# Altium schematic sheet Receiver.SchDoc
size A4
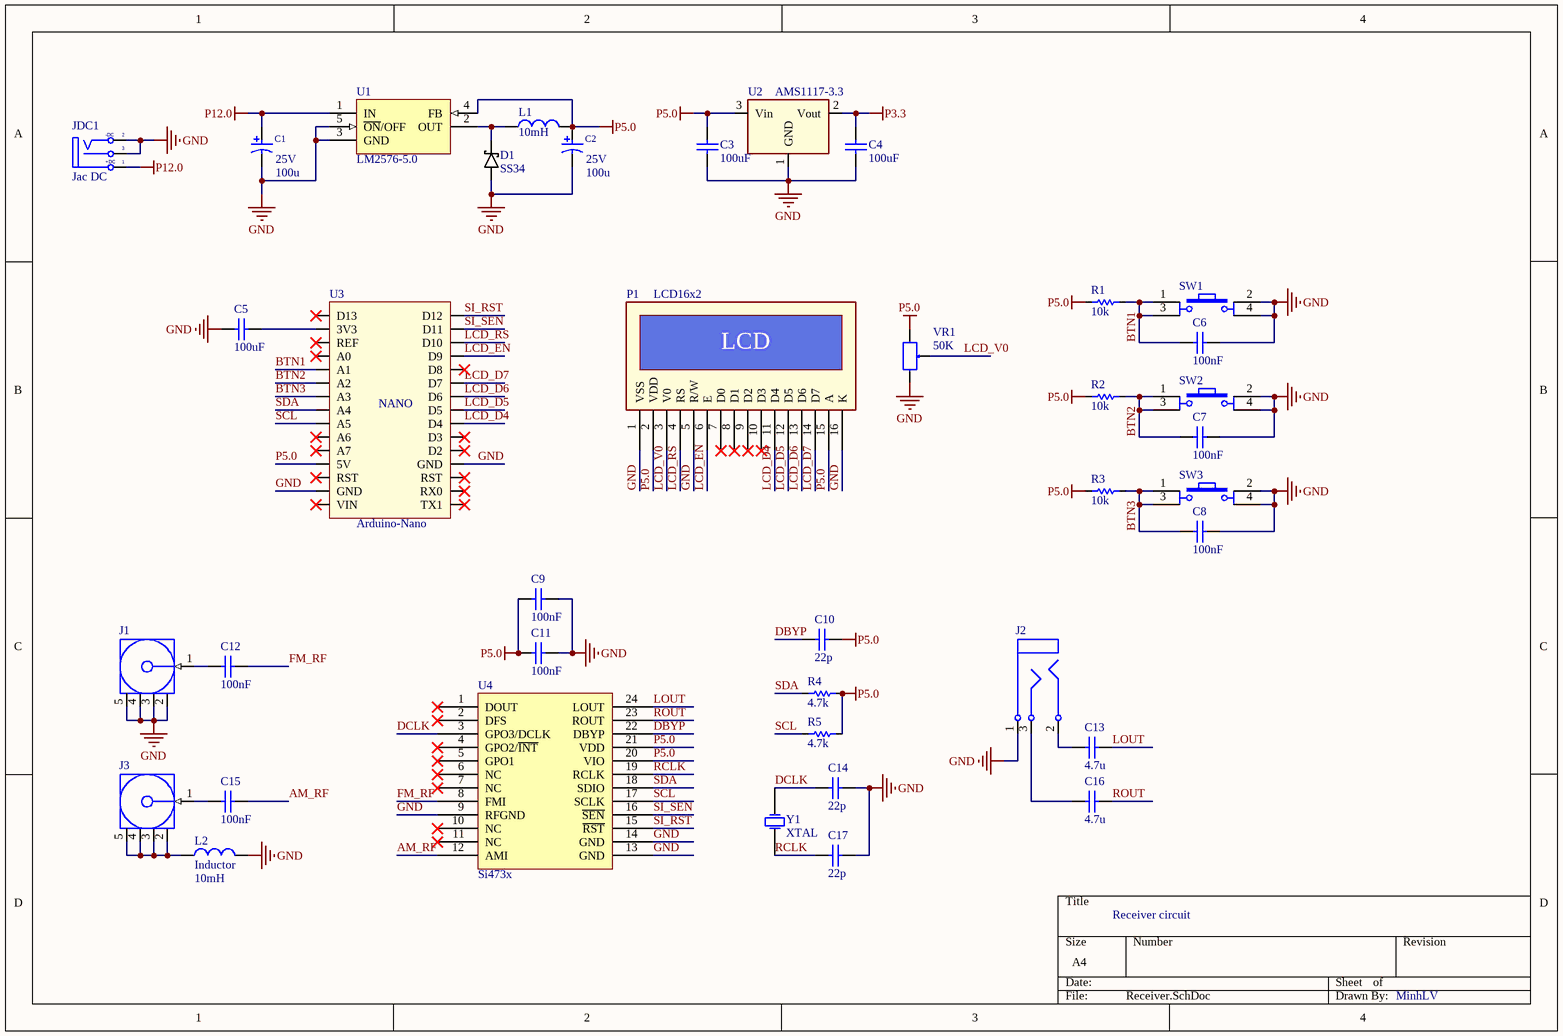
[diagram p0: Receiver.SchDoc]

## Parts
C1  Volt: 25V  [CAP_SMD_6_3MM]  (hidden comment: 100u)
C2  Volt: 25V  [CAP_SMD_6_3MM]  (hidden comment: 100u)
C3  value 100uF  [CAP_SMD_0805]  (hidden comment: Cap Non-pol)
C4  value 100uF  [CAP_SMD_0805]  (hidden comment: Cap Non-pol)
C5  value 100uF  [CAP_SMD_0805]  (hidden comment: Cap Non-pol)
C6  value 100nF  [CAP_SMD_0805]  (hidden comment: Cap Non-pol)
C7  value 100nF  [CAP_SMD_0805]  (hidden comment: Cap Non-pol)
C8  value 100nF  [CAP_SMD_0805]  (hidden comment: Cap Non-pol)
C9  value 100nF  [CAP_SMD_0805]  (hidden comment: Cap Non-pol)
C10  value 22p  [CAP_SMD_0805]  (hidden comment: Cap Non-pol)
C11  value 100nF  [CAP_SMD_0805]  (hidden comment: Cap Non-pol)
C12  value 100nF  [CAP_SMD_0805]  (hidden comment: Cap Non-pol)
C13  value 4.7u  [CAP_SMD_0805]  (hidden comment: Cap Non-pol)
C14  value 22p  [CAP_SMD_0805]  (hidden comment: Cap Non-pol)
C15  value 100nF  [CAP_SMD_0805]  (hidden comment: Cap Non-pol)
C16  value 4.7u  [CAP_SMD_0805]  (hidden comment: Cap Non-pol)
C17  value 22p  [CAP_SMD_0805]  (hidden comment: Cap Non-pol)
D1  SS34  [DO-214AC,SMA]
J1  SMA Connector  [SMA-CONNECTOR]  (value not drawn)
J2  CON.AudioJack Stereo  [SJ-3523-SMT]  (value not drawn)
J3  SMA Connector  [SMA-CONNECTOR]  (value not drawn)
JDC1  Jac DC  [DC-IN]
L1  value 10mH  [CDRH104]  (hidden comment: Inductor)
L2  Inductor  value 10mH  [CDRH104]
P1  LCD16x2  [LCD16x2]
R1  value 10k  [RES_SMD_0805]  (hidden comment: RESISTOR)
R2  value 10k  [RES_SMD_0805]  (hidden comment: RESISTOR)
R3  value 10k  [RES_SMD_0805]  (hidden comment: RESISTOR)
R4  value 4.7k  [RES_SMD_0805]  (hidden comment: RESISTOR)
R5  value 4.7k  [RES_SMD_0805]  (hidden comment: RESISTOR)
SW1  SW  [SW4]  (value not drawn)
SW2  SW  [SW4]  (value not drawn)
SW3  SW  [SW4]  (value not drawn)
U1  LM2576-5.0  [LM2576_SMD]
U2  AMS1117-3.3  [SOT223]
U3  Arduino-Nano  [Arduino Nano]
U4  Si473x  [SSOP-24]
VR1  50K  [VR]
Y1  XTAL  [XT32k]

## Nets
GND: C1.2 C2.2 C3.1 C4.1 C5.1 C6.1 C7.1 C8.1 C9.2 C11.2 C14.1 C17.1 D1.1(A) J1.2(GND) J1.3(GND) J1.4(GND) J1.5(GND) J2.1 JDC1.2(TN) JDC1.3(S) L2.2 P1.1(VSS) P1.5(R/W) P1.16(K) SW1.2 SW1.4 SW2.2 SW2.4 SW3.2 SW3.4 U1.3(GND) U1.5(~{ON}/OFF) U2.1(GND) U3.GND U4.9(RFGND) U4.13(GND) U4.14(GND) VR1.3
P3.3: C4.2 U2.2(Vout)
P5.0: C2.1 C3.2 C9.1 C10.1 C11.1 L1.2 P1.2(VDD) P1.15(A) R1.1 R2.1 R3.1 R4.2 R5.2 U1.4(FB) U2.3(Vin) U3.5V U4.20(VIO) U4.21(VDD) VR1.1
P12.0: C1.1 JDC1.1(T) U1.1(IN)
AM_RF: C15.2 U4.12(AMI)
BTN1: C6.2 R1.2 SW1.1 SW1.3 U3.A1
BTN2: C7.2 R2.2 SW2.1 SW2.3 U3.A2
BTN3: C8.2 R3.2 SW3.1 SW3.3 U3.A3
DBYP: C10.2 U4.22(DBYP)
DCLK: C14.2 U4.3(GPO3/DCLK) Y1.1(OSC1)
FM_RF: C12.2 U4.8(FMI)
LCD_D4: P1.11(D4) U3.D4
LCD_D5: P1.12(D5) U3.D5
LCD_D6: P1.13(D6) U3.D6
LCD_D7: P1.14(D7) U3.D7
LCD_EN: P1.6(E) U3.D9
LCD_RS: P1.4(RS) U3.D10
LCD_V0: P1.3(V0) VR1.2
LOUT: C13.1 U4.24(LOUT)
RCLK: C17.2 U4.19(RCLK) Y1.2(OSC2)
ROUT: C16.1 U4.23(ROUT)
SCL: R5.1 U3.A5 U4.17(SCLK)
SDA: R4.1 U3.A4 U4.18(SDIO)
SI_RST: U3.D12 U4.15(~{RST})
SI_SEN: U3.D11 U4.16(~{SEN})
NetC5_2: C5.2 U3.3V3
NetC12_1: C12.1 J1.1(Signal)
NetC13_2: C13.2 J2.2
NetC15_1: C15.1 J3.1(Signal)
NetC16_2: C16.2 J2.3
NetD1_2: D1.2(K) L1.1 U1.2(OUT)
NetJ3_2: J3.2(GND) J3.3(GND) J3.4(GND) J3.5(GND) L2.1

Not connected (* = marked no-connect by the designer): P1 7(D0)* 8(D1)* 9(D2)* 10(D3)*; U3 A0* A6* A7* D2* D3* D8* D13* REF* RST* RX0* TX1* VIN*; U4 1(DOUT)* 2(DFS)* 4(GPO2/~{INT})* 5(GPO1)* 6(NC)* 7(NC)* 10(NC)* 11(NC)*

## Notes on the sheet
- Receiver circuit
- MinhLV
- (in symbol Arduino Nano) NANO
- (in symbol DCIN) -DC; +DC
- (in symbol LCD Text) LCD

## Library data of the parts
C1 C2 = Cap_Pol: Polarized Capacitor; Manufacturer: FARNELL; AEMS Code: 2100110; Vendor: Digikey; Capacitor Type: Tant; Published: 13-April-2009; Publisher: Hoang Nguyen; ComponentLink1Description: Digikey Part Link; ComponentLink2Description: Open Datasheet; ComponentLink2URL: H:\LIBRARY\LIBRARY.Datasheet\; Value: 100u
C3-C17 = Cap Non-pol: Non-polarized Capacitor; LatestRevisionNote: Re-released for DXP Platform.; PackageReference: RAD-0.3; Publisher: Altium Limited
D1 = DIODE S
J1 J3 = SMA Connector: SMA Connector Jack, Female Socket 50Ohm Surface Mount, Right Angle Solder; MP: SMA-J-P-GF-RA-SM1; MF: Samtec; Price: None; Availability: Unavailable; Value: *; Package: None
J2 = CON.AudioJack Stereo: AUDIO JACK 3.5MM STEREO SMD; Vendor: Digi-Key; Vendor P/N: CP-3523SJTR-ND; Published: 5-Jan-2004; DatasheetDocument: 07-Mar-2000; Publisher: Altium Limited; Mounting Type: Surface Mount, Right Angle; ComponentLink1Description: Digikey Part link; ComponentLink1URL: http://search.digikey.com/scripts/DkSearch/dksus.dll?Detail&name=CP-3523SJTR-ND; ComponentLink2Description: Open DataSheet; ComponentLink2URL: H:\LIBRARY\LIBRARY.Datasheet\
JDC1 = DCIN: Jac DC input; Value: Jac DC
L1 L2 = Inductor: Code_IEC: 1005; Published: 8-Jun-2000; LatestRevisionDate: 17-Jul-2002; LatestRevisionNote: Re-released for DXP Platform.; PackageReference: 0402-A; Publisher: Altium Limited; Code_JEITA: 0402
P1 = LCD Text
SW1-SW3 = SW4: Switch button 4 pin; Value: Button chip 4 pin
U1 = LM2576: Simple Switcher 3A Step Down Voltage Regulator; Note: Tab is connected to GND; Published: 15-Apr-2002; DatasheetVersion: May-1999; PackageVersion: 2000; PackageReference: T05A; Publisher: Altium Limited; PackageDescription: TO, Thru-Hole, Vertical, Heatsink Mounted; 5 In-Line Leads; Pitch 1.70 mm; Code_JEDEC: TS-001-AA; ComponentLink1Description: Manufacturer Link; ComponentLink1URL: http://www.national.com/; ComponentLink2Description: Datasheet; ComponentLink2URL: H:\LIBRARY\LIBRARY.Datasheet\LM2576.pdf; ComponentLink3Description: URL Link1; ComponentLink3URL: http://www.national.com/pf/LM/LM2575HV.html; Price: 15000 VND
U2 = AMS1117: Regulator SMD Chip; Designed By: John MacTavish; Vendor: Digikey; ComponentLink1Description: Digikey Part Link; ComponentLink2Description: Open Datasheet; ComponentLink2URL: H:\LIBRARY\LIBRARY.Datasheet\
U3 = Arduino Nano: Value: Cau 1A
VR1 = VR: Var Resistor; Value: VR 10K
Y1 = XTAL: Crystal Oscillator; Published: 8-Jun-2000; LatestRevisionDate: 17-Jul-2002; LatestRevisionNote: Re-released for DXP Platform.; PackageReference: R38; Publisher: Altium Limited
R1-R5 = RESISTOR: Published: 8-Jun-2000; LatestRevisionDate: 17-Jul-2002; LatestRevisionNote: Re-released for DXP Platform.; PackageReference: AXIAL-0.3; Publisher: Altium Limited